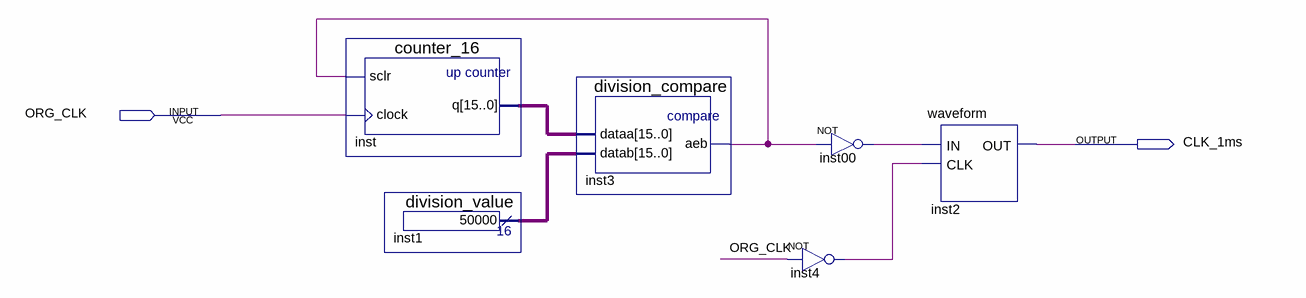
[diagram p0: schematic sheet]
// Quartus schematic clk_1ms.bdf as structural Verilog: 6 symbols, 2 pins
module clk_1ms (
  input  ORG_CLK,
  output CLK_1ms
);

  wire inst00_out, inst3_aeb, inst4_out;
  wire [15:0] inst1_result, inst_q;

  counter_16 inst (.sclr(inst3_aeb), .clock(ORG_CLK), .q(inst_q));
  division_value inst1 (.result(inst1_result));
  division_compare inst3 (.dataa(inst_q), .datab(inst1_result), .aeb(inst3_aeb));
  not inst00 (inst00_out, inst3_aeb);
  not inst4 (inst4_out, ORG_CLK);
  waveform inst2 (.IN(inst00_out), .CLK(inst4_out), .OUT(CLK_1ms));
endmodule
